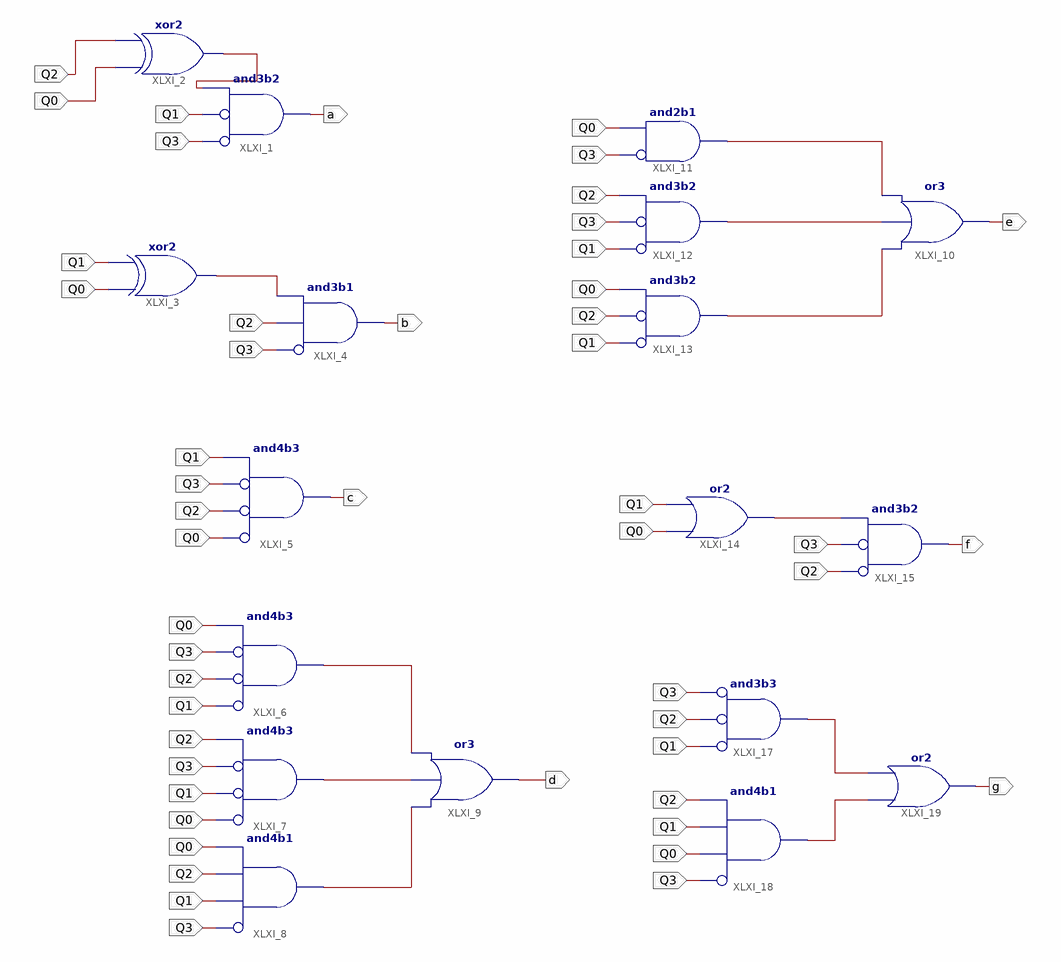
[diagram p0: schematic sheet 1]
// Xilinx ISE schematic segment_design.sch (spartan3) as structural Verilog: 18 symbols, 11 ports
module segment_design (
  input  Q2,
  input  Q0,
  input  Q1,
  input  Q3,
  output a,
  output b,
  output c,
  output d,
  output e,
  output f,
  output g
);

  wire XLXN_1, XLXN_10, XLXN_23, XLXN_24, XLXN_25, XLXN_39, XLXN_40, XLXN_41, XLXN_51, XLXN_57, XLXN_58;

  and XLXI_1 (a, ~Q3, ~Q1, XLXN_1);  // and3b2
  xor XLXI_2 (XLXN_1, Q0, Q2);
  xor XLXI_3 (XLXN_10, Q0, Q1);
  and XLXI_4 (b, ~Q3, Q2, XLXN_10);  // and3b1
  and XLXI_5 (c, ~Q0, ~Q2, ~Q3, Q1);  // and4b3
  and XLXI_6 (XLXN_23, ~Q1, ~Q2, ~Q3, Q0);  // and4b3
  and XLXI_7 (XLXN_24, ~Q0, ~Q1, ~Q3, Q2);  // and4b3
  and XLXI_8 (XLXN_25, ~Q3, Q1, Q2, Q0);  // and4b1
  or XLXI_9 (d, XLXN_25, XLXN_24, XLXN_23);
  or XLXI_10 (e, XLXN_41, XLXN_40, XLXN_39);
  and XLXI_11 (XLXN_39, ~Q3, Q0);  // and2b1
  and XLXI_12 (XLXN_40, ~Q1, ~Q3, Q2);  // and3b2
  and XLXI_13 (XLXN_41, ~Q1, ~Q2, Q0);  // and3b2
  or XLXI_14 (XLXN_51, Q0, Q1);
  and XLXI_15 (f, ~Q2, ~Q3, XLXN_51);  // and3b2
  and XLXI_17 (XLXN_57, ~Q1, ~Q2, ~Q3);  // and3b3
  and XLXI_18 (XLXN_58, ~Q3, Q0, Q1, Q2);  // and4b1
  or XLXI_19 (g, XLXN_58, XLXN_57);
endmodule
